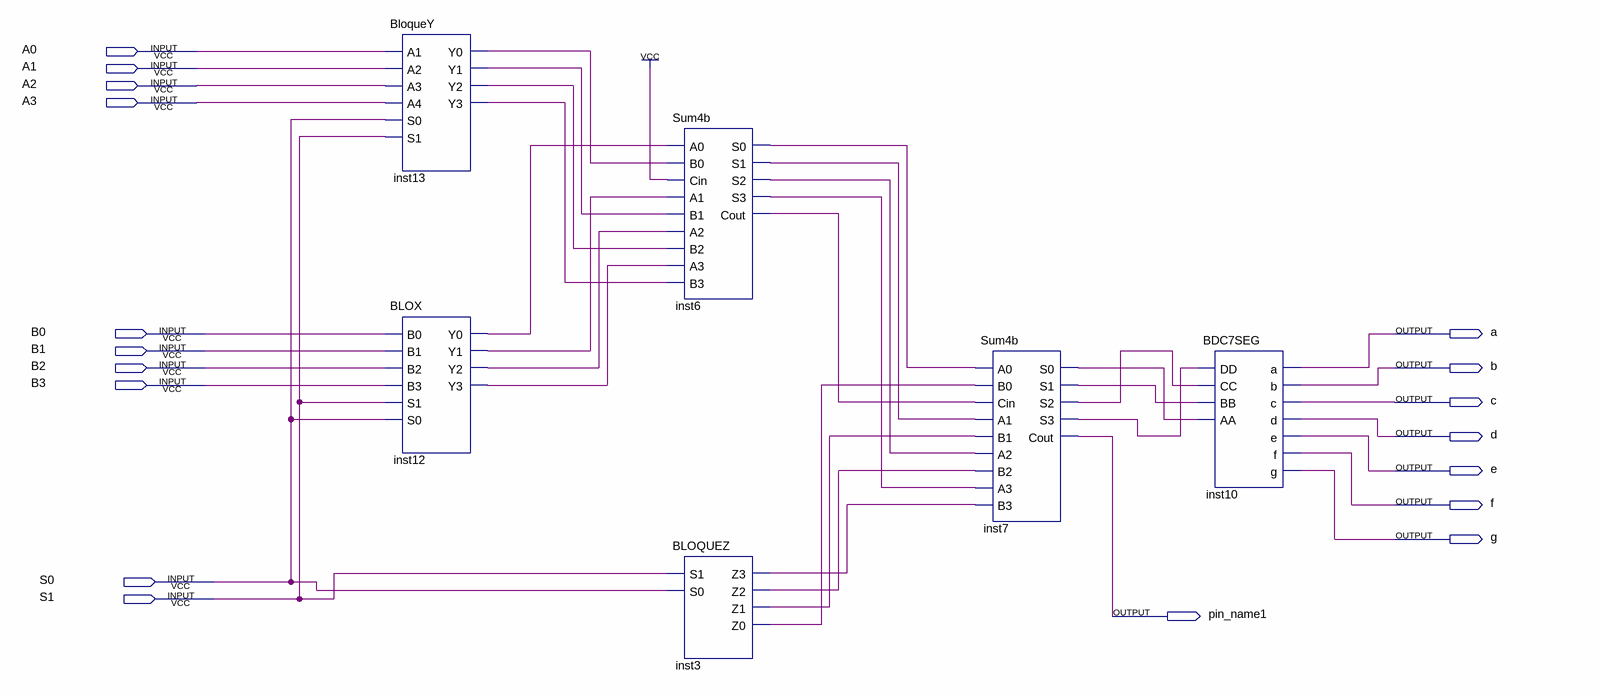
[diagram p0: schematic sheet]
// Quartus schematic FUA.bdf as structural Verilog: 6 symbols, 18 pins
module FUA (
  input  A0,
  input  A1,
  input  A2,
  input  A3,
  input  B0,
  input  B1,
  input  B2,
  input  B3,
  input  S0,
  input  S1,
  output a,
  output b,
  output c,
  output d,
  output e,
  output f,
  output g,
  output pin_name1
);

  wire inst3_z0, inst3_z1, inst3_z2, inst3_z3, inst6_cout, inst6_s0, inst6_s1, inst6_s2, inst6_s3, inst7_s0,
       inst7_s1, inst7_s2, inst7_s3, inst12_y0, inst12_y1, inst12_y2, inst12_y3, inst13_y0, inst13_y1,
       inst13_y2, inst13_y3;

  BloqueY inst13 (
    .A1(A0), .A2(A1), .A3(A2), .A4(A3), .S0(S0), .S1(S1), .Y0(inst13_y0), .Y1(inst13_y1), .Y2(inst13_y2),
    .Y3(inst13_y3));
  BLOX inst12 (
    .B0(B0), .B1(B1), .B2(B2), .B3(B3), .S1(S1), .S0(S0), .Y0(inst12_y0), .Y1(inst12_y1), .Y2(inst12_y2),
    .Y3(inst12_y3));
  Sum4b inst6 (
    .A0(inst12_y0), .B0(inst13_y0), .Cin(1'b1), .A1(inst12_y1), .B1(inst13_y1), .A2(inst12_y2),
    .B2(inst13_y2), .A3(inst12_y3), .B3(inst13_y3), .S0(inst6_s0), .S1(inst6_s1), .S2(inst6_s2),
    .S3(inst6_s3), .Cout(inst6_cout));
  BLOQUEZ inst3 (.S1(S1), .S0(S0), .Z3(inst3_z3), .Z2(inst3_z2), .Z1(inst3_z1), .Z0(inst3_z0));
  Sum4b inst7 (
    .A0(inst6_s0), .B0(inst3_z0), .Cin(inst6_cout), .A1(inst6_s1), .B1(inst3_z1), .A2(inst6_s2),
    .B2(inst3_z2), .A3(inst6_s3), .B3(inst3_z3), .S0(inst7_s0), .S1(inst7_s1), .S2(inst7_s2), .S3(inst7_s3),
    .Cout(pin_name1));
  BDC7SEG inst10 (
    .DD(inst7_s3), .CC(inst7_s2), .BB(inst7_s1), .AA(inst7_s0), .a(a), .b(b), .c(c), .d(d), .e(e), .f(f),
    .g(g));
endmodule
